# EAGLE design PCB-BI8-SE-C201 (EAGLE 7.5.0)
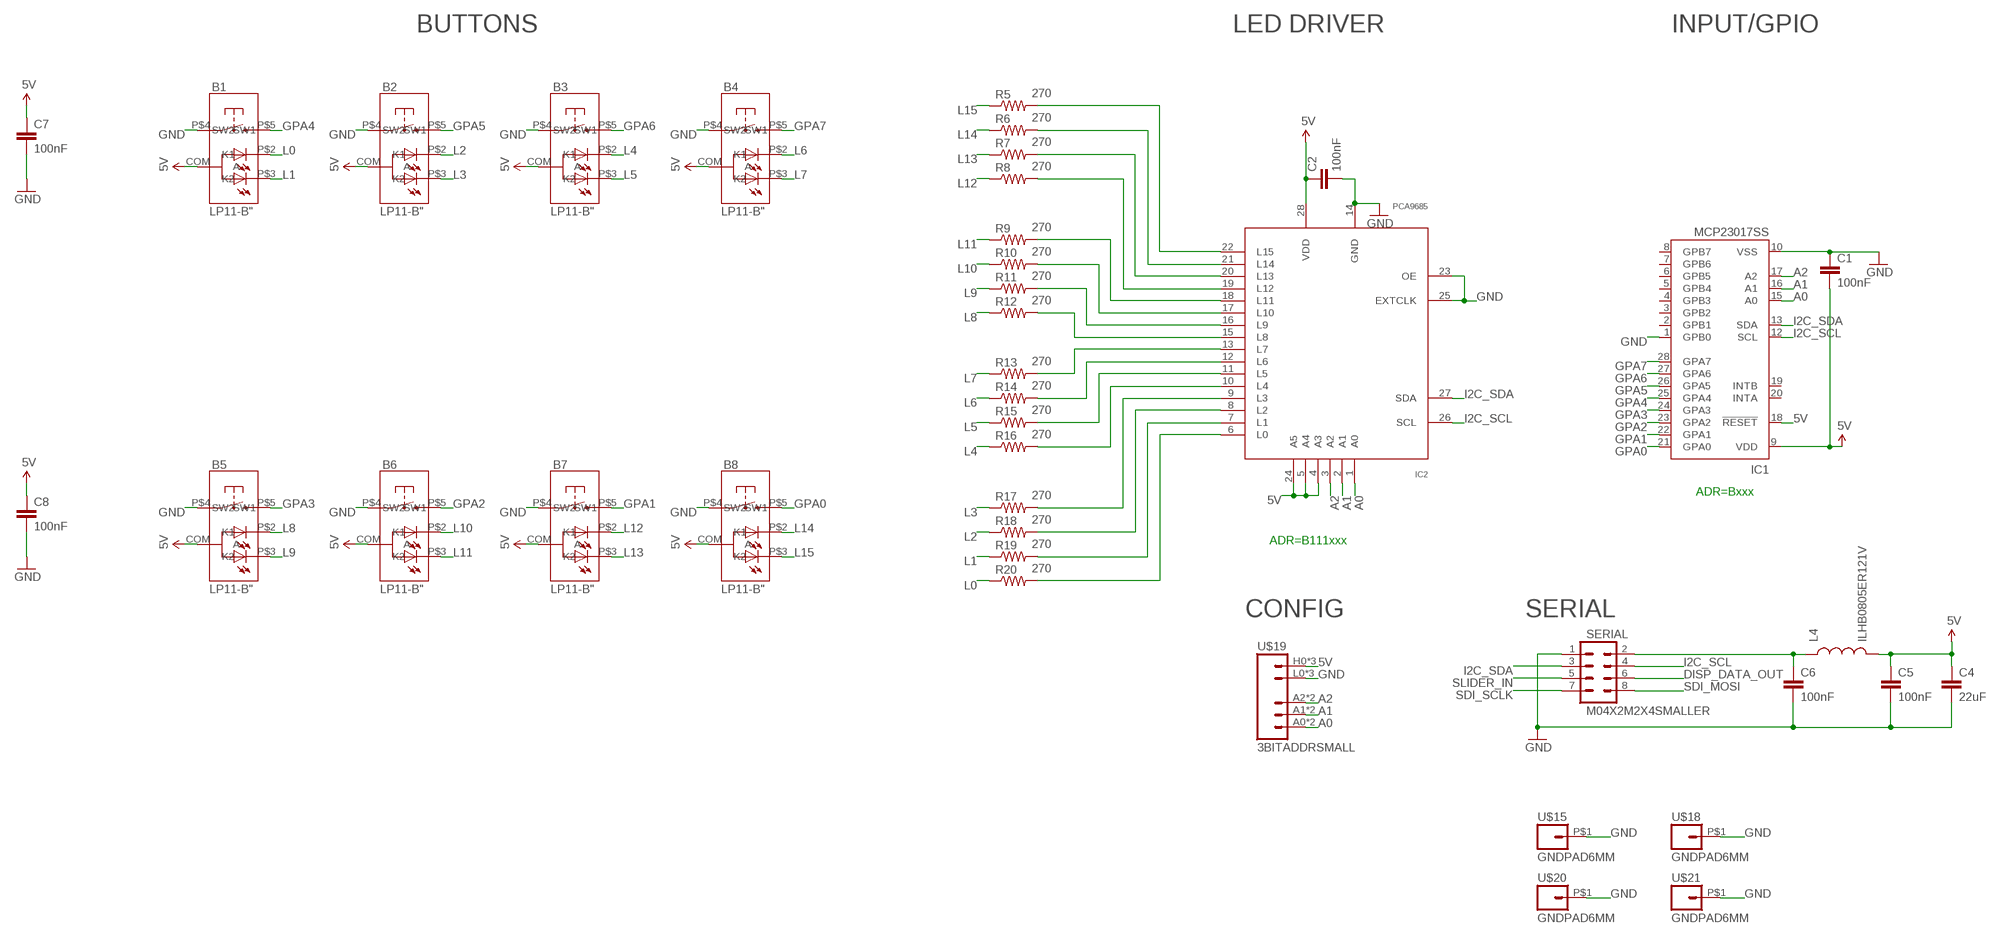
[diagram p0: schematic, sheet 1]

## Parts
B1  LP11-B"  [LP11]
B2  LP11-B"  [LP11]
B3  LP11-B"  [LP11]
B4  LP11-B"  [LP11]
B5  LP11-B"  [LP11]
B6  LP11-B"  [LP11]
B7  LP11-B"  [LP11]
B8  LP11-B"  [LP11]
C1  100nF  CAP0603-CAP  [0603-CAP]
C2  100nF  CAP0603-CAP  [0603-CAP]
C4  22uF  CAP0805  [0805]
C5  100nF  CAP0603-CAP  [0603-CAP]
C6  100nF  CAP0603-CAP  [0603-CAP]
C7  100nF  CAP0603-CAP  [0603-CAP]
C8  100nF  CAP0603-CAP  [0603-CAP]
IC1  MCP23017SS  [SSOP28]
IC2  PCA9685  [TSSOP28]
L4  ILHB0805ER121V  INDUCTOR0805  [0805]
R5  270  RESISTOR0603-RES  [0603-RES]
R6  270  RESISTOR0603-RES  [0603-RES]
R7  270  RESISTOR0603-RES  [0603-RES]
R8  270  RESISTOR0603-RES  [0603-RES]
R9  270  RESISTOR0603-RES  [0603-RES]
R10  270  RESISTOR0603-RES  [0603-RES]
R11  270  RESISTOR0603-RES  [0603-RES]
R12  270  RESISTOR0603-RES  [0603-RES]
R13  270  RESISTOR0603-RES  [0603-RES]
R14  270  RESISTOR0603-RES  [0603-RES]
R15  270  RESISTOR0603-RES  [0603-RES]
R16  270  RESISTOR0603-RES  [0603-RES]
R17  270  RESISTOR0603-RES  [0603-RES]
R18  270  RESISTOR0603-RES  [0603-RES]
R19  270  RESISTOR0603-RES  [0603-RES]
R20  270  RESISTOR0603-RES  [0603-RES]
SERIAL  M04X2M2X4SMALLER  [M2X4SMALLER]
U$15  GNDPAD6MM  [3.2MMPAD6MM]
U$18  GNDPAD6MM  [3.2MMPAD6MM]
U$19  3BITADDRSMALL  [3BITADDR_SMALL]
U$20  GNDPAD6MM  [3.2MMPAD6MM]
U$21  GNDPAD6MM  [3.2MMPAD6MM]

## Nets
5V [Power]: B1.COM(A) B2.COM(A) B3.COM(A) B4.COM(A) B5.COM(A) B6.COM(A) B7.COM(A) B8.COM(A) C1.2 C2.1 C4.1 C5.1 C7.1 C8.1 IC1.9(VDD) IC1.18(!RESET) IC2.4(A3) IC2.5(A4) IC2.24(A5) IC2.28(VDD) L4.2 U$19.H0(VCC) U$19.H1(VCC) U$19.H2(VCC)
A0: IC1.15(A0) IC2.1(A0) U$19.A0 U$19.AS0(A0)
A1: IC1.16(A1) IC2.2(A1) U$19.A1 U$19.AS1(A1)
A2: IC1.17(A2) IC2.3(A2) U$19.A2 U$19.AS2(A2)
DISP_DATA_OUT: SERIAL.6
GND [Power]: B1.P$4(SW1) B2.P$4(SW1) B3.P$4(SW1) B4.P$4(SW1) B5.P$4(SW1) B6.P$4(SW1) B7.P$4(SW1) B8.P$4(SW1) C1.1 C2.2 C4.2 C5.2 C6.2 C7.2 C8.2 IC1.1(GPB0) IC1.10(VSS) IC2.14(GND) IC2.23(OE) IC2.25(EXTCLK) SERIAL.1 U$15.P$1 U$18.P$1 U$19.L0(GND) U$19.L1(GND) U$19.L2(GND) U$20.P$1 U$21.P$1
GPA0: B8.P$5(SW2) IC1.21(GPA0)
GPA1: B7.P$5(SW2) IC1.22(GPA1)
GPA2: B6.P$5(SW2) IC1.23(GPA2)
GPA3: B5.P$5(SW2) IC1.24(GPA3)
GPA4: B1.P$5(SW2) IC1.25(GPA4)
GPA5: B2.P$5(SW2) IC1.26(GPA5)
GPA6: B3.P$5(SW2) IC1.27(GPA6)
GPA7: B4.P$5(SW2) IC1.28(GPA7)
I2C_SCL: IC1.12(SCL) IC2.26(SCL) SERIAL.4
I2C_SDA: IC1.13(SDA) IC2.27(SDA) SERIAL.3
L0: B1.P$2(K1) R20.1
L1: B1.P$3(K2) R19.1
L2: B2.P$2(K1) R18.1
L3: B2.P$3(K2) R17.1
L4: B3.P$2(K1) R16.1
L5: B3.P$3(K2) R15.1
L6: B4.P$2(K1) R14.1
L7: B4.P$3(K2) R13.1
L8: B5.P$2(K1) R12.1
L9: B5.P$3(K2) R11.1
L10: B6.P$2(K1) R10.1
L11: B6.P$3(K2) R9.1
L12: B7.P$2(K1) R8.1
L13: B7.P$3(K2) R7.1
L14: B8.P$2(K1) R6.1
L15: B8.P$3(K2) R5.1
N$1 [Power]: C6.1 L4.1 SERIAL.2
N$4: IC2.13(L7) R13.2
N$5: IC2.12(L6) R14.2
N$7: IC2.11(L5) R15.2
N$9: IC2.10(L4) R16.2
N$10: IC2.9(L3) R17.2
N$11: IC2.8(L2) R18.2
N$12: IC2.7(L1) R19.2
N$19: IC2.6(L0) R20.2
N$20: IC2.15(L8) R12.2
N$21: IC2.16(L9) R11.2
N$22: IC2.17(L10) R10.2
N$23: IC2.18(L11) R9.2
N$24: IC2.19(L12) R8.2
N$25: IC2.20(L13) R7.2
N$26: IC2.21(L14) R6.2
N$27: IC2.22(L15) R5.2
SDI_MOSI: SERIAL.8
SDI_SCLK: SERIAL.7
SLIDER_IN: SERIAL.5
Unconnected: IC1.2(GPB1) IC1.3(GPB2) IC1.4(GPB3) IC1.5(GPB4) IC1.6(GPB5) IC1.7(GPB6) IC1.8(GPB7) IC1.19(INTB) IC1.20(INTA)

## Notes on the sheet
- BUTTONS | LED DRIVER | INPUT/GPIO
- ADR=Bxxx
- ADR=B111xxx
- CONFIG | SERIAL

## Library data of the parts
B1-B8 = SKAARHOJ:LP11-B
C1 C2 C4-C8 = SparkFun:CAP: Capacitor Standard 0603 ceramic capacitor, and 0.1" leaded capacitor.
IC1 = microchip:MCP23017: http://ww1.microchip.com/downloads/en/DeviceDoc/21952a.pdf Source: http://ww1.microchip.com/downloads/en/DeviceDoc/21952a.pdf; MF: MICROCHIP; MPN: MCP23017-E/SS; OC_FARNELL: 1467674; OC_NEWARK: 31K2960
IC2 = wsmith:PCA9685
L4 = SparkFun:INDUCTOR: Inductors Basic Inductor/Choke - 0603 and 1206. Footprints are not proven and vary greatly between part numbers.
R5-R20 = SparkFun:RESISTOR: Resistor Basic schematic elements and footprints for 0603, 1206, and PTH resistors.
SERIAL = SKAARHOJ:M04X2
U$15 U$18 U$20 U$21 = SKAARHOJ:GNDPAD
U$19 = SKAARHOJ:3BITADDR

## Net classes
0 default: width 0.203 mm, drill 0.406 mm, clearance 0.203 mm
1 Power: width 0.406 mm, drill 0.61 mm, clearance 0.203 mm

## Board
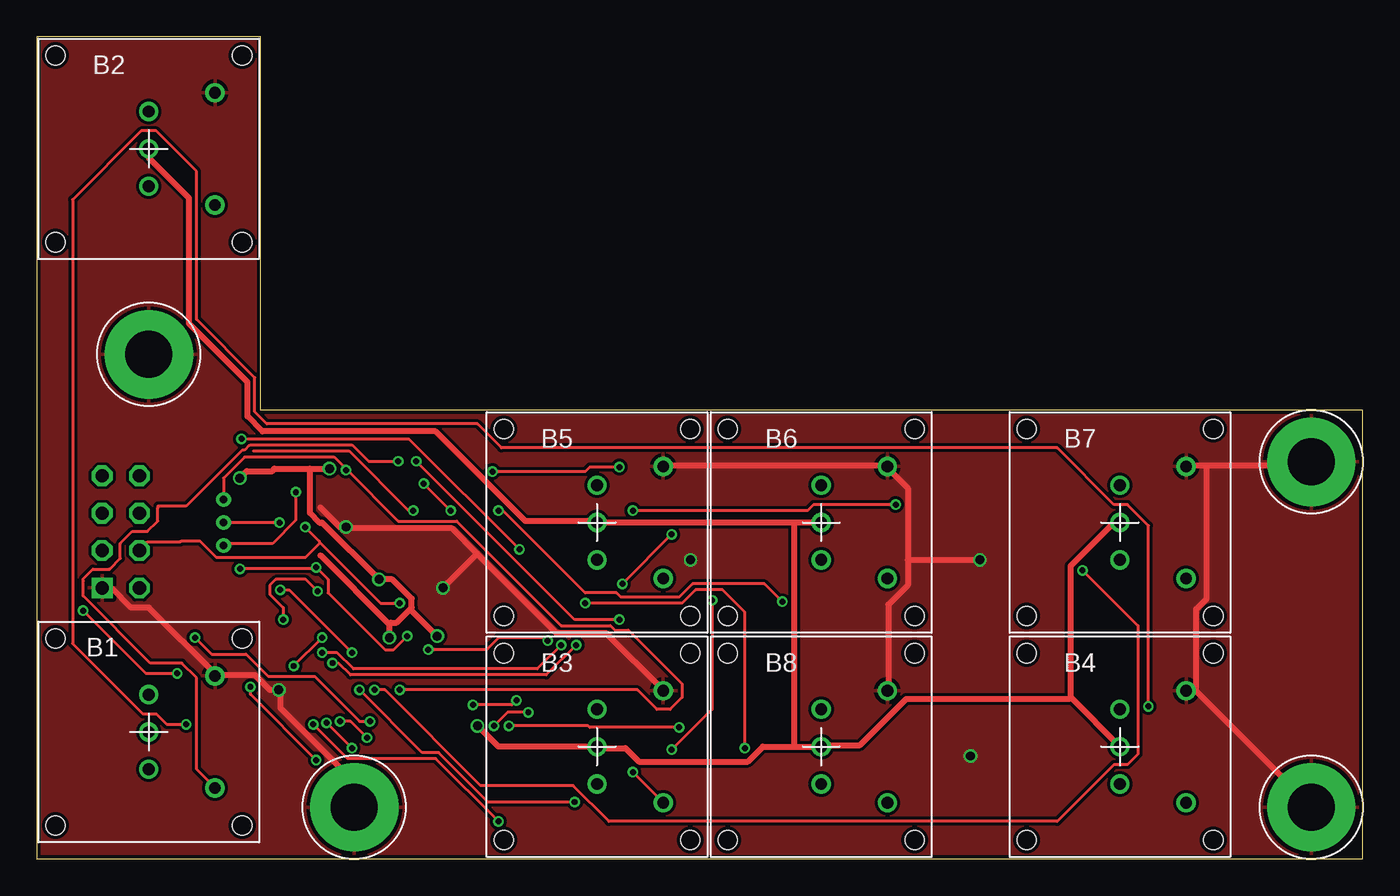
[diagram p1: board, top side]
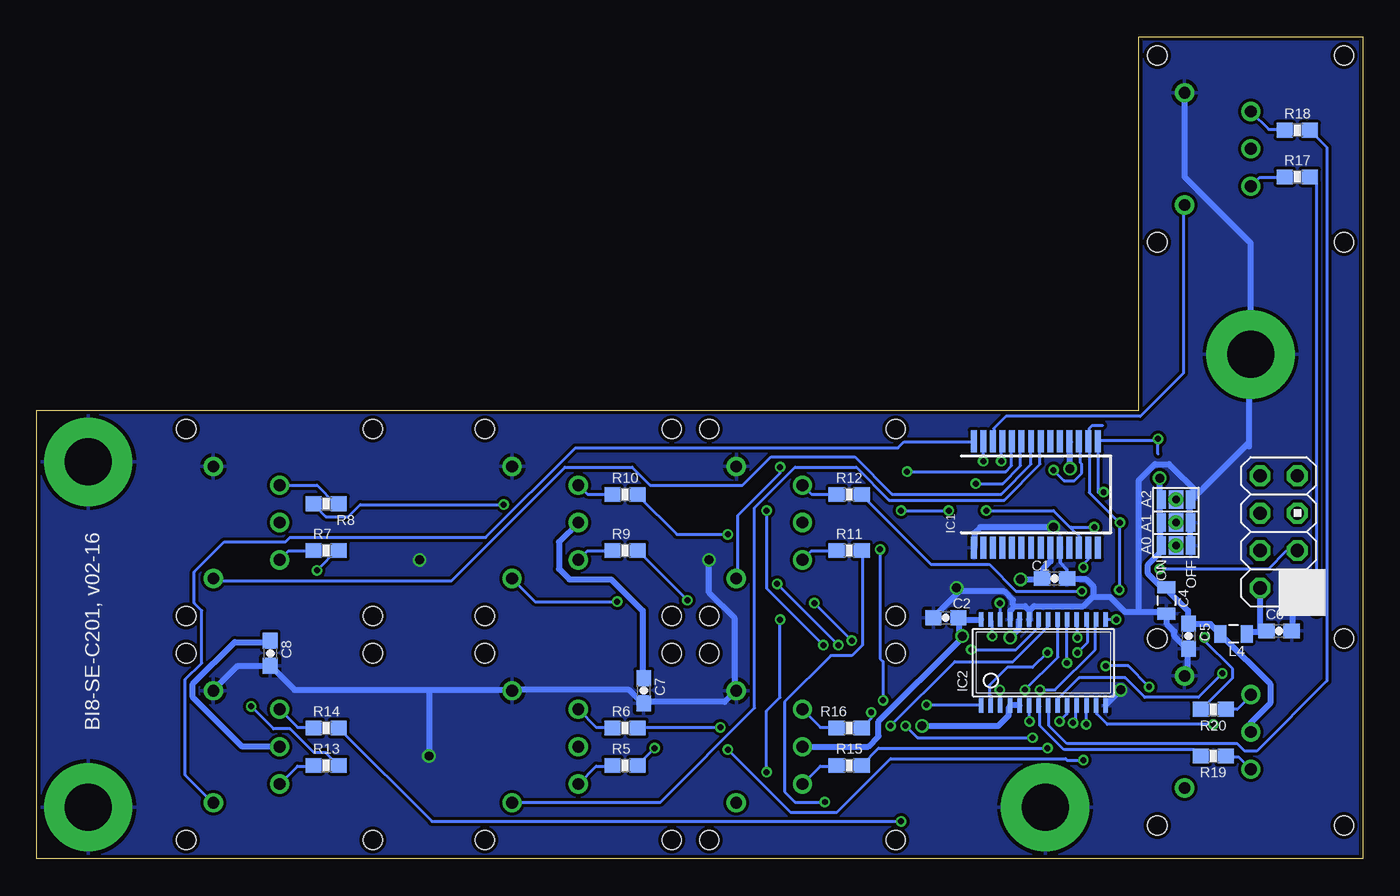
[diagram p2: board, bottom side, seen from below]

Size 90.17 x 55.88 mm. Coordinates in mm from the lower left corner, seen from the top.
Outline: 0,0 90.17,0 90.17,30.48 15.24,30.48 15.24,55.88 0,55.88 0,0
Copper layers (1*16): Top 0.035mm / dielectric 1.5mm / Bottom 0.035mm
Design rules "Fusion_eagle_rule_v1.1": minimum track width 6mil, minimum drill 12mil, track to track 6mil, track to pad 6mil, pad to pad 6mil, via to via 6mil, smd to smd 0mil, copper to edge 10mil, drill to drill 10mil, minimum pad ring 10mil, minimum via ring 6mil, stop-mask expansion 2mil, vias tented up to drill 100mil, thermal gap 10mil

### Footprints (pad centres in the part's own frame; a part is rotated, then mirrored left to right if it is on the bottom)
LP11 = drill 0.8: COM 0,0; P$2 0,2.54; P$3 0,-2.54; P$4 4.5,3.81; P$5 4.5,-3.81 | hole 1.3: -6.35,6.35; 6.35,6.35; 6.35,-6.35; -6.35,-6.35
0603-CAP = smd 1.1 x 1: 1 -0.85,0; 2 0.85,0
0805 = smd 0.8 x 1.2: 1 -0.9,0; 2 0.9,0
SSOP28 = smd 0.4 x 1.5: 1 -4.225,-3.625; 2 -3.575,-3.625; 3 -2.925,-3.625; 4 -2.275,-3.625; 5 -1.625,-3.625; 6 -0.975,-3.625; 7 -0.325,-3.625; 8 0.325,-3.625; 9 0.975,-3.625; 10 1.625,-3.625; 11 2.275,-3.625; 12 2.925,-3.625; 13 3.575,-3.625; 14 4.225,-3.625; 15 4.225,3.625; 16 3.575,3.625; 17 2.925,3.625; 18 2.275,3.625; 19 1.625,3.625; 20 0.975,3.625; 21 0.325,3.625; 22 -0.325,3.625; 23 -0.975,3.625; 24 -1.625,3.625; 25 -2.275,3.625; 26 -2.925,3.625; 27 -3.575,3.625; 28 -4.225,3.625
TSSOP28 = smd 0.305 x 0.991: 1 -4.225,-2.918; 2 -3.575,-2.918; 3 -2.925,-2.918; 4 -2.275,-2.918; 5 -1.625,-2.918; 6 -0.975,-2.918; 7 -0.325,-2.918; 8 0.325,-2.918; 9 0.975,-2.918; 10 1.625,-2.918; 11 2.275,-2.918; 12 2.925,-2.918; 13 3.575,-2.918; 14 4.225,-2.918; 15 4.225,2.918; 16 3.575,2.918; 17 2.925,2.918; 18 2.275,2.918; 19 1.625,2.918; 20 0.975,2.918; 21 0.325,2.918; 22 -0.325,2.918; 23 -0.975,2.918; 24 -1.625,2.918; 25 -2.275,2.918; 26 -2.925,2.918; 27 -3.575,2.918; 28 -4.225,2.918
0603-RES = smd 1.1 x 1: 1 -0.85,0; 2 0.85,0
M2X4SMALLER = drill 0.9 square: 1 -1.27,3.81 | drill 0.9 octagon: 2 1.27,3.81; 3 -1.27,1.27; 4 1.27,1.27; 5 -1.27,-1.27; 6 1.27,-1.27; 7 -1.27,-3.81; 8 1.27,-3.81
3.2MMPAD6MM = drill 3.2 pad 6: P$1 0,0
3BITADDR_SMALL = drill 0.5: A0 -1.565,0; A1 0,0; A2 1.565,0 | smd 1.27 x 1: AS0 -1.565,0; AS1 0,0; AS2 1.565,0 | smd 1.27 x 0.635: H0 -1.565,1; H1 0,1; H2 1.565,1; L0 -1.565,-1; L1 0,-1; L2 1.565,-1

### Placement (x,y rotation side)
B1  7.62,8.62 0 top
B2  7.62,48.26 0 top
B3  38.1,7.62 0 top
B4  73.66,7.62 0 top
B5  38.1,22.86 0 top
B6  53.34,22.86 0 top
B7  73.66,22.86 0 top
B8  53.34,7.62 0 top
C1  20.95,19.05 180 bottom
C2  28.35,16.38 180 bottom
C4  13.36,17.55 270 bottom
C5  11.84,15.14 270 bottom
C6  5.69,15.49 0 bottom
C7  48.9,11.43 270 bottom
C8  74.3,13.97 270 bottom
IC1  22.23,24.77 0 bottom
IC2  21.72,13.34 0 bottom
L4  8.79,15.29 180 bottom
R5  50.16,6.35 0 bottom
R6  50.16,8.89 0 bottom
R7  70.48,20.95 0 bottom
R8  70.48,24.13 180 bottom
R9  50.16,20.95 0 bottom
R10  50.16,24.77 0 bottom
R11  34.92,20.95 0 bottom
R12  34.92,24.77 0 bottom
R13  70.48,6.35 0 bottom
R14  70.48,8.89 0 bottom
R15  34.92,6.35 0 bottom
R16  34.92,8.89 0 bottom
R17  4.45,46.35 0 bottom
R18  4.45,49.53 0 bottom
R19  10.16,6.99 180 bottom
R20  10.16,10.16 180 bottom
SERIAL  5.71,22.23 180 bottom
U$15  7.62,34.29 0 top
U$18  21.59,3.5 0 top
U$19  12.7,22.86 90 bottom
U$20  86.67,3.5 0 top
U$21  86.67,26.98 0 top

### Tracks (layer width: path | path; a pad name or v marks a point on that pad's centre or on a via)
5V  (via drill 0.61)
  Top 0.406: B6.COM 51.51,22.86 | 51.51,22.86 B5.COM 38,22.96 33.22,22.96 27.13,29.06 15.34,29.06 14.33,30.07 14.33,32.41 10.36,36.37 10.36,44.91 7.62,47.65 B2.COM | 18.57,26.52 16.15,26.52 16.03,26.35 14.29,26.35 v13.81,25.88 | 18.57,26.52 v19.91,26.52 | 23.98,15.95 v23.98,15.04 | 19.3,20.62 23.98,15.95 | 25.4,16.97 24.49,16.05 24.08,16.05 23.98,15.95 | 25.4,16.97 25.5,17.07 25.5,17.68 24.18,19 v23.27,19 19.41,22.86 19.21,22.86 18.57,23.5 18.57,26.52 | B7.COM 73.25,22.86 70.31,19.91 70.31,10.97 | B4.COM 70.31,10.97 | v29.97,9.04 31.39,7.62 B3.COM 38.2,7.52 40.03,7.52 40.95,6.6 48.36,6.6 49.38,7.62 51.51,7.62 | 51.51,7.62 B8.COM 53.44,7.72 55.98,7.72 59.13,10.87 70.21,10.87 70.31,10.97 | v27.23,15.14 25.4,16.97 | 51.51,7.62 51.51,22.86
  Bottom 0.406: B6.COM 54.66,21.54 54.66,19.71 53.95,19 51.1,19 48.97,16.87 48.97,12.29 C7.1 | v19.91,26.52 19.91,28.35 IC1.18 | IC1.9 21.23,21.13 21.23,20.22 21.74,19.71 21.74,19.1 C1.2 21.95,19 v23.27,19 | v23.98,15.04 23.37,15.65 23.37,16.15 IC2.24 | B1.COM 7.62,9.25 6.3,10.57 6.3,11.89 9.55,15.14 L4.2 9.75,15.34 10.36,15.95 11.79,15.95 C5.1 11.89,16.15 11.89,16.87 13.31,18.29 C4.1 13.49,18.26 14.61,19.37 14.61,20 13.81,20.8 13.81,21.11 U$19.H0 13.81,21.43 13.81,22.86 U$19.H1 13.81,23.02 13.81,24.29 U$19.H2 13.81,24.61 v13.81,25.88 | B4.COM 76.2,7.62 79.55,10.97 79.55,11.89 76.71,14.73 74.37,14.73 C8.1 | IC2.28 26.01,16.26 27.33,16.26 27.43,16.36 C2.1 27.43,16.15 27.43,15.14 | IC2.5 23.37,10.46 23.98,10.46 IC2.4 24.08,10.26 24.08,9.75 24.79,9.04 v29.97,9.04 | 27.43,15.14 27.43,14.83 32.92,9.35 32.92,8.33 33.63,7.62 B3.COM | v27.23,15.14 27.43,15.14
A0  (via drill 0.41)
  Top 0.203: v29.67,10.46 32.31,10.46 v32.61,10.77 | v32.82,21.03 25.3,28.55 v13.92,28.55 | v17.62,24.92 17.62,23.02 16.03,21.43 12.7,21.43 U$19.AS0
  Bottom 0.203: v29.67,10.46 26.01,10.46 IC2.1 | v32.61,10.77 32.61,13.41 32.82,13.61 v32.82,21.03 | 13.92,27.53 v13.92,28.55 13.97,28.42 17.94,28.42 IC1.15 17.98,28.35 17.98,24.92 | 17.98,24.89 17.98,24.92 | 12.7,21.27 U$19.AS0 | 17.98,24.92 v17.62,24.92
A1  (via drill 0.41)
  Top 0.203: v21.44,14.02 17.17,18.29 v16.56,18.29 | v16.51,22.86 U$19.AS1
  Bottom 0.203: v21.44,14.02 22.45,13.01 24.18,13.01 25.4,11.79 25.4,11.18 25.3,11.07 25.3,10.46 IC2.2 | 16.56,22.86 v16.56,18.29 | 16.56,22.86 18.59,24.89 18.59,28.35 IC1.16 18.59,28.45 18.59,29.26 18.39,29.46 17.68,29.46 | v16.51,22.86 16.56,22.86
A2  (via drill 0.41)
  Top 0.203: v24.69,11.48 40.84,11.48 42.16,10.16 43.08,10.16 43.89,10.97 43.89,11.89 40.23,15.54 39.32,15.54 39.01,15.85 35.66,15.85 28.55,22.96 24.59,22.96 21.08,26.47 | 21.08,26.47 20.22,27.33 14.94,27.33 14.92,27.3 14.13,27.3 12.7,25.88 U$19.AS2 | v21.03,26.42 21.08,26.47
  Bottom 0.203: v24.69,11.48 24.69,10.46 IC2.3 | v21.03,26.42 20.32,25.7 19.61,25.7 19.1,26.21 19.1,26.82 19.2,26.92 19.2,28.35 IC1.17 | 12.7,24.45 U$19.AS2
GND  (via drill 0.6, 0.61)
  Top 0.406: 19.3,23.88 20.62,22.55 v21.03,22.55 21.13,22.45 28.25,22.45 29.95,20.75 | SERIAL.1 4.47,18.39 5.08,18.39 6.4,17.07 7.62,17.07 12.09,12.6 B1.P$4 12.19,12.5 14.83,12.5 15.85,11.48 v16.46,11.48 16.56,11.38 16.56,10.26 21.54,5.28 21.54,3.56 U$18.P$1 | B5.P$4 42.67,26.72 57.81,26.72 B6.P$4 57.91,26.52 59.23,25.2 59.23,20.32 | 59.23,20.32 59.23,18.59 57.91,17.27 57.91,11.48 B8.P$4 | 79.55,26.72 86.46,26.72 86.67,26.92 U$21.P$1 | 79.55,26.72 78.23,26.72 B7.P$4 | U$20.P$1 86.67,3.56 78.84,11.38 78.23,11.38 B4.P$4 78.84,11.48 78.84,16.97 79.55,17.68 79.55,26.72 | 29.95,20.75 35.36,15.34 38.71,15.34 42.57,11.48 B3.P$4 | 59.23,20.32 v64.14,20.32 | 29.95,20.75 v27.62,18.41
  Bottom 0.254: C1.1 20.11,19.65 20.57,20.12 20.57,21.11 IC1.10
  Bottom 0.406: B2.P$4 12.09,52.02 12.09,46.33 7.62,41.86 U$15.P$1 7.72,34.14 7.72,28.26 | 22.66,16.87 22.66,16.26 IC2.23 | 22.66,16.87 22.96,17.17 23.67,17.17 | 23.67,17.17 23.98,16.87 23.98,16.26 IC2.25 | 27.43,18.19 29.16,16.46 C2.2 | 27.43,18.19 24.38,18.19 23.77,17.58 23.77,17.27 23.67,17.17 | 18.29,17.88 18.29,18.49 18.8,19 20.02,19 C1.1 | 18.29,17.88 19,17.17 22.35,17.17 22.66,16.87 | v16.46,11.48 17.48,10.46 IC2.14 | B1.P$4 12.09,12.5 11.89,12.7 11.89,14.22 C5.2 11.99,14.33 12.8,15.14 12.8,15.44 13.31,15.95 13.31,16.56 C4.2 13.51,16.76 15.24,16.76 | 15.24,16.76 16.15,16.76 17.17,17.78 18.19,17.78 18.29,17.88 | SERIAL.1 4.78,18.09 4.78,15.54 C6.2 | v21.03,22.55 26.01,22.55 26.42,22.15 26.42,21.23 IC1.1 | 7.72,28.04 7.72,28.26 | B4.P$4 78.13,11.48 76.5,13.11 74.37,13.11 C8.2 74.17,13.01 72.64,11.48 63.5,11.48 | 63.5,11.48 58.01,11.48 B8.P$4 57.81,11.48 49.89,11.48 49.07,10.67 C7.2 48.87,10.67 43.38,10.67 42.67,11.38 B3.P$4 42.7,11.59 42.7,16.35 44.45,18.1 v44.45,20.32 | U$19.L0 11.75,21.43 11.75,22.86 U$19.L1 11.75,23.02 11.75,24.29 U$19.L2 11.59,24.45 11.19,24.84 | 11.19,24.84 7.78,28.26 7.72,28.26 | 11.19,24.84 13.18,26.83 14.13,26.83 15.24,25.72 15.24,16.76 | 63.5,11.48 v63.5,6.99 | v27.62,18.41 27.62,18.26 27.43,18.19
  pour Top: 0,0 90.17,0 90.17,55.88 0,55.88
  pour Bottom: 0,0 90.17,0 90.17,55.88 0,55.88
GPA0
  Bottom 0.203: IC1.21 21.95,28.35 21.95,26.82 24.38,24.38 32.21,24.38 34.44,26.62 38.61,26.62 41.35,23.88 41.35,10.26 47.75,3.86 57.81,3.86 B8.P$5
GPA1
  Bottom 0.203: IC1.22 22.55,28.35 22.55,26.82 24.59,24.79 32,24.79 34.54,27.33 40.23,27.33 42.16,25.4 48.46,25.4 49.68,26.62 54.25,26.62 61.98,18.9 78.03,18.9 78.13,19 B7.P$5
GPA2  (via drill 0.41)
  Top 0.203: v28.14,23.67 v26.31,25.5 | v31.39,23.67 31.7,23.67 37.29,18.09 39.42,18.09 39.73,17.78 43.69,17.78 44.6,18.69 49.48,18.69 v50.7,17.48
  Bottom 0.203: v26.31,25.5 24.49,25.5 23.27,26.72 23.27,28.35 IC1.23 | v31.39,23.67 v28.14,23.67 | v50.7,17.48 56.29,17.48 57.81,19 B6.P$5
GPA3  (via drill 0.41)
  Top 0.203: v30.99,26.31 37.29,26.31 37.59,26.62 v39.62,26.62
  Bottom 0.203: v30.99,26.31 24.28,26.31 23.88,26.72 23.88,28.35 IC1.24 | v39.62,26.62 39.62,26.21 42.47,23.37 42.47,19.2 42.57,19.1 B5.P$5
GPA4  (via drill 0.41)
  Top 0.203: v24.59,27.03 22.55,27.03 21.44,28.14 14.53,28.14 14.45,28.1 14.13,27.78 13.97,27.78 10.16,23.97 8.26,23.97 8.23,23.88 8.23,22.96 7.52,22.25 6.5,22.25 5.69,21.44 5.69,20.42 4.98,19.71 4.92,19.68 3.81,19.68 3.17,19.05 3.17,18.89 3.15,18.89 | 3.15,18.89 3.15,17.88 7.72,13.31 9.86,13.31 10.87,12.29 10.87,6.1 12.09,4.88 B1.P$5 | 3.15,18.89 3.15,18.9
  Bottom 0.203: v24.59,27.03 24.59,28.35 IC1.25
GPA5
  Bottom 0.203: IC1.26 25.09,28.45 25.09,29.26 24.28,30.07 15.14,30.07 12.19,33.02 12.19,44.4 B2.P$5
GPA6  (via drill 0.41)
  Top 0.203: v25.81,27.03 36.58,16.26 v39.62,16.26 | v40.54,5.89 42.57,3.86 B3.P$5
  Bottom 0.203: v25.81,27.03 25.81,28.35 IC1.27 | v39.62,16.26 39.62,10.97 40.54,10.06 v40.54,5.89
GPA7
  Bottom 0.203: IC1.28 26.52,28.35 31.19,28.35 31.6,27.94 53.54,27.94 59.64,21.84 72.95,21.84 73.25,21.54 77.42,21.54 79.45,19.51 79.45,17.37 78.94,16.87 78.94,13.31 80.06,12.19 80.06,5.69 78.23,3.86 B4.P$5
I2C_SCL  (via drill 0.41)
  Top 0.203: v24.69,17.37 23.37,17.37 19.26,21.48 | 19.26,21.48 19.2,21.54 19.21,21.59 v18.26,22.54 | SERIAL.4 7.01,21.03 7.52,21.54 9.75,21.54 9.84,21.59 11.11,21.59 12.22,20.48 18.26,20.48 19.26,21.48 | v25.6,23.67 25.3,23.67 21.23,27.74 14.73,27.74
  Bottom 0.203: v24.69,17.37 24.69,16.26 IC2.26 | 19.87,22.51 21.03,23.67 v25.6,23.67 | 19.87,22.51 19.3,21.95 19.3,21.23 IC1.12 | v18.26,22.54 19.84,22.54 19.87,22.51
I2C_SDA  (via drill 0.41)
  Top 0.203: v25.2,15.14 24.28,14.22 23.67,14.22 19.81,18.09 19.81,19 v19,19.81 19,19.71 v13.82,19.71
  Bottom 0.203: v25.2,15.14 25.2,16.15 IC2.27 | v19,19.81 19,20.02 18.69,20.32 18.69,21.13 IC1.13 | v13.82,19.71 6.4,19.71 5.18,20.93 4.47,20.93 SERIAL.3
L0
  Bottom 0.203: R20.1 8.53,10.16 7.62,11.07 B1.P$2
L1
  Bottom 0.203: R19.1 9.25,6.91 8.43,6.91 7.62,6.1 B1.P$3
L2
  Bottom 0.203: B2.P$2 6.4,49.58 5.38,49.58 R18.1
L3
  Bottom 0.203: B2.P$3 7.01,46.33 5.38,46.33 R17.1
L4
  Bottom 0.203: B3.P$2 36.88,8.94 35.87,8.94 R16.1
L5
  Bottom 0.203: B3.P$3 36.88,6.3 35.87,6.3 R15.1
L6
  Bottom 0.203: B4.P$2 72.44,8.94 71.42,8.94 R14.1
L7
  Bottom 0.203: B4.P$3 72.44,6.3 71.42,6.3 R13.1
L8
  Bottom 0.203: B5.P$2 37.49,24.79 35.87,24.79 R12.1
L9
  Bottom 0.203: B5.P$3 37.49,20.93 35.87,20.93 R11.1
L10
  Bottom 0.203: B6.P$2 52.73,24.79 51.1,24.79 R10.1
L11
  Bottom 0.203: B6.P$3 52.73,20.93 51.1,20.93 R9.1
L12
  Bottom 0.203: B7.P$2 71.12,25.4 69.9,24.18 69.7,24.18 R8.1
L13
  Bottom 0.203: B7.P$3 73.05,20.93 71.42,20.93 R7.1
L14
  Bottom 0.203: B8.P$2 52.12,8.94 51.1,8.94 R6.1
L15
  Bottom 0.203: B8.P$3 52.12,6.3 51.1,6.3 R5.1
N$1
  Bottom 0.406: L4.1 7.82,15.34 7.72,15.44 6.6,15.44 C6.1 7.01,15.54 7.01,18.39 SERIAL.2
N$4  (via drill 0.41)
  Top 0.203: v10.16,9.14 8.84,9.14 8.13,9.86 7.21,9.86 2.44,14.63 2.44,44.81 7.11,49.48 8.13,49.48 10.87,46.74 10.87,36.68 14.83,32.72 14.83,30.38 15.65,29.57 29.97,29.57 31.6,27.94 69.39,27.94 73.25,24.08 74.17,24.08 75.59,22.66 v75.59,10.36
  Bottom 0.203: v10.16,9.14 17.37,9.14 18.09,9.86 18.09,10.36 IC2.13 | v75.59,10.36 74.07,8.84 72.95,8.84 71.32,7.21 70.51,7.21 69.7,6.4 R13.2
N$5  (via drill 0.41)
  Top 0.203: v18.8,9.14 21.13,6.81 27.13,6.81 v31.39,2.54
  Bottom 0.203: v18.8,9.14 18.8,10.36 IC2.12 | v31.39,2.54 63.3,2.54 69.6,8.84 R14.2
N$7  (via drill 0.41)
  Top 0.203: v21.44,7.52 v19.71,9.25
  Bottom 0.203: v19.71,9.25 19.51,9.45 19.51,10.36 IC2.11 | v21.44,7.52 32.92,7.52 34.04,6.4 R15.2
N$9  (via drill 0.41)
  Top 0.203: v20.62,9.35 21.34,9.35 v22.45,8.23 | v31.09,9.04 32,9.96 v33.43,9.96
  Bottom 0.203: v20.62,9.35 20.12,9.86 20.12,10.36 IC2.10 | v22.45,8.23 30.28,8.23 v31.09,9.04 | v33.43,9.96 33.43,9.55 34.04,8.94 R16.2
N$10  (via drill 0.41)
  Top 0.203: v9.55,12.6 7.42,12.6 v3.15,16.87
  Bottom 0.203: v9.55,12.6 11.18,10.97 14.83,10.97 16.15,12.29 19.3,12.29 20.73,10.87 20.73,10.46 IC2.9 | v3.15,16.87 3.15,45.92 3.56,46.33 R17.2
N$11
  Bottom 0.203: IC2.8 21.34,10.36 21.34,9.04 20.12,7.82 8.53,7.82 8.03,7.32 7.21,7.32 2.44,12.09 2.44,48.36 3.56,49.48 R18.2
N$12
  Bottom 0.203: IC2.7 21.95,10.36 21.95,9.04 20.32,7.42 11.48,7.42 11.07,7.01 R19.2
N$19  (via drill 0.41)
  Top 0.203: v22.66,9.35 21.95,9.35 18.9,12.39 15.75,12.39 14.22,13.92 11.89,13.92 v10.77,15.04
  Bottom 0.203: v22.66,9.35 22.66,10.36 IC2.6 | v10.77,15.04 10.77,14.83 8.84,12.9 8.84,12.29 10.97,10.16 R20.2
N$20  (via drill 0.41)
  Top 0.203: v16.76,16.26 16.76,17.07 15.85,17.98 15.85,18.59 16.26,19 18.29,19 v19.1,18.19
  Bottom 0.203: v16.76,16.26 17.48,16.26 IC2.15 | v19.1,18.19 23.57,18.19 25.4,20.02 29.36,20.02 34.04,24.69 R12.2
N$21  (via drill 0.41)
  Top 0.203: v21.95,11.48 26.21,7.21 27.33,7.21 30.68,3.86 v36.58,3.86
  Bottom 0.203: v21.95,11.48 20.93,11.48 18.19,14.22 18.19,16.15 IC2.16 | v36.58,3.86 38.61,3.86 39.32,4.57 39.32,10.67 36.17,13.82 34.75,13.82 34.04,14.53 34.04,20.93 R11.2
N$22  (via drill 0.41)
  Top 0.203: v19.41,14.02 20.42,14.02 21.54,12.9 34.04,12.9 v35.66,14.53 | v43.18,22.05 v39.83,18.69
  Bottom 0.203: v19.41,14.02 18.69,14.73 18.69,16.15 IC2.17 | v39.83,18.69 v35.66,14.53 | v43.18,22.05 46.63,22.05 49.28,24.69 R10.2
N$23  (via drill 0.41)
  Top 0.203: v17.48,13.11 v19.41,15.04 | v14.53,11.68 14.53,11.18 v19,6.71 | v43.18,7.42 45.92,10.16 v45.92,17.58
  Bottom 0.203: v19.41,15.04 19.41,16.15 IC2.18 | v17.48,13.11 15.95,13.11 v14.53,11.68 | v19,6.71 20.12,6.71 20.22,6.81 32.11,6.81 35.76,3.15 38.91,3.15 v43.18,7.42 | v45.92,17.58 49.28,20.93 R9.2
N$24  (via drill 0.41)
  Top 0.203: v20.12,13.31 20.52,13.31 21.34,12.5 34.65,12.5 v36.68,14.53 | v40.54,23.67 52.43,23.67 52.83,24.08 v58.42,24.08
  Bottom 0.203: v20.12,13.31 20.12,16.15 IC2.19 | v36.68,14.53 40.54,18.39 v40.54,23.67 | v58.42,24.08 68.17,24.08 68.99,23.27 70.51,23.27 71.32,24.08 R8.2
N$25  (via drill 0.41)
  Top 0.203: v22.96,11.48 23.67,11.48 30.18,4.98 36.47,4.98 38.91,2.54 69.39,2.54 73.25,6.4 74.17,6.4 74.88,7.11 74.88,15.85 v71.12,19.61
  Bottom 0.203: v22.96,11.48 20.73,13.72 20.73,16.15 IC2.20 | v71.12,19.61 69.7,21.03 R7.2
N$26  (via drill 0.41)
  Top 0.203: v32.11,9.04 37.49,9.04 37.59,8.94 v43.69,8.94
  Bottom 0.203: v32.11,9.04 27.74,13.41 23.77,13.41 21.44,15.75 21.44,16.15 IC2.21 | v43.69,8.94 49.28,8.94 R6.2
N$27  (via drill 0.41)
  Top 0.203: v26.62,14.22 30.58,14.22 31.39,15.04 34.54,15.04 v34.75,14.83 | v37.29,17.37 43.89,17.37 44.81,18.29 46.63,18.29 48.16,16.76 v48.16,7.52
  Bottom 0.203: v26.62,14.22 23.57,14.22 22.05,15.75 22.05,16.15 IC2.22 | v37.29,17.37 v34.75,14.83 | v48.16,7.52 49.28,6.4 R5.2

### Text on the board
_bsilk: BI8-SE-C201, v02-16